# EAGLE design MagEnc (EAGLE 4.15)
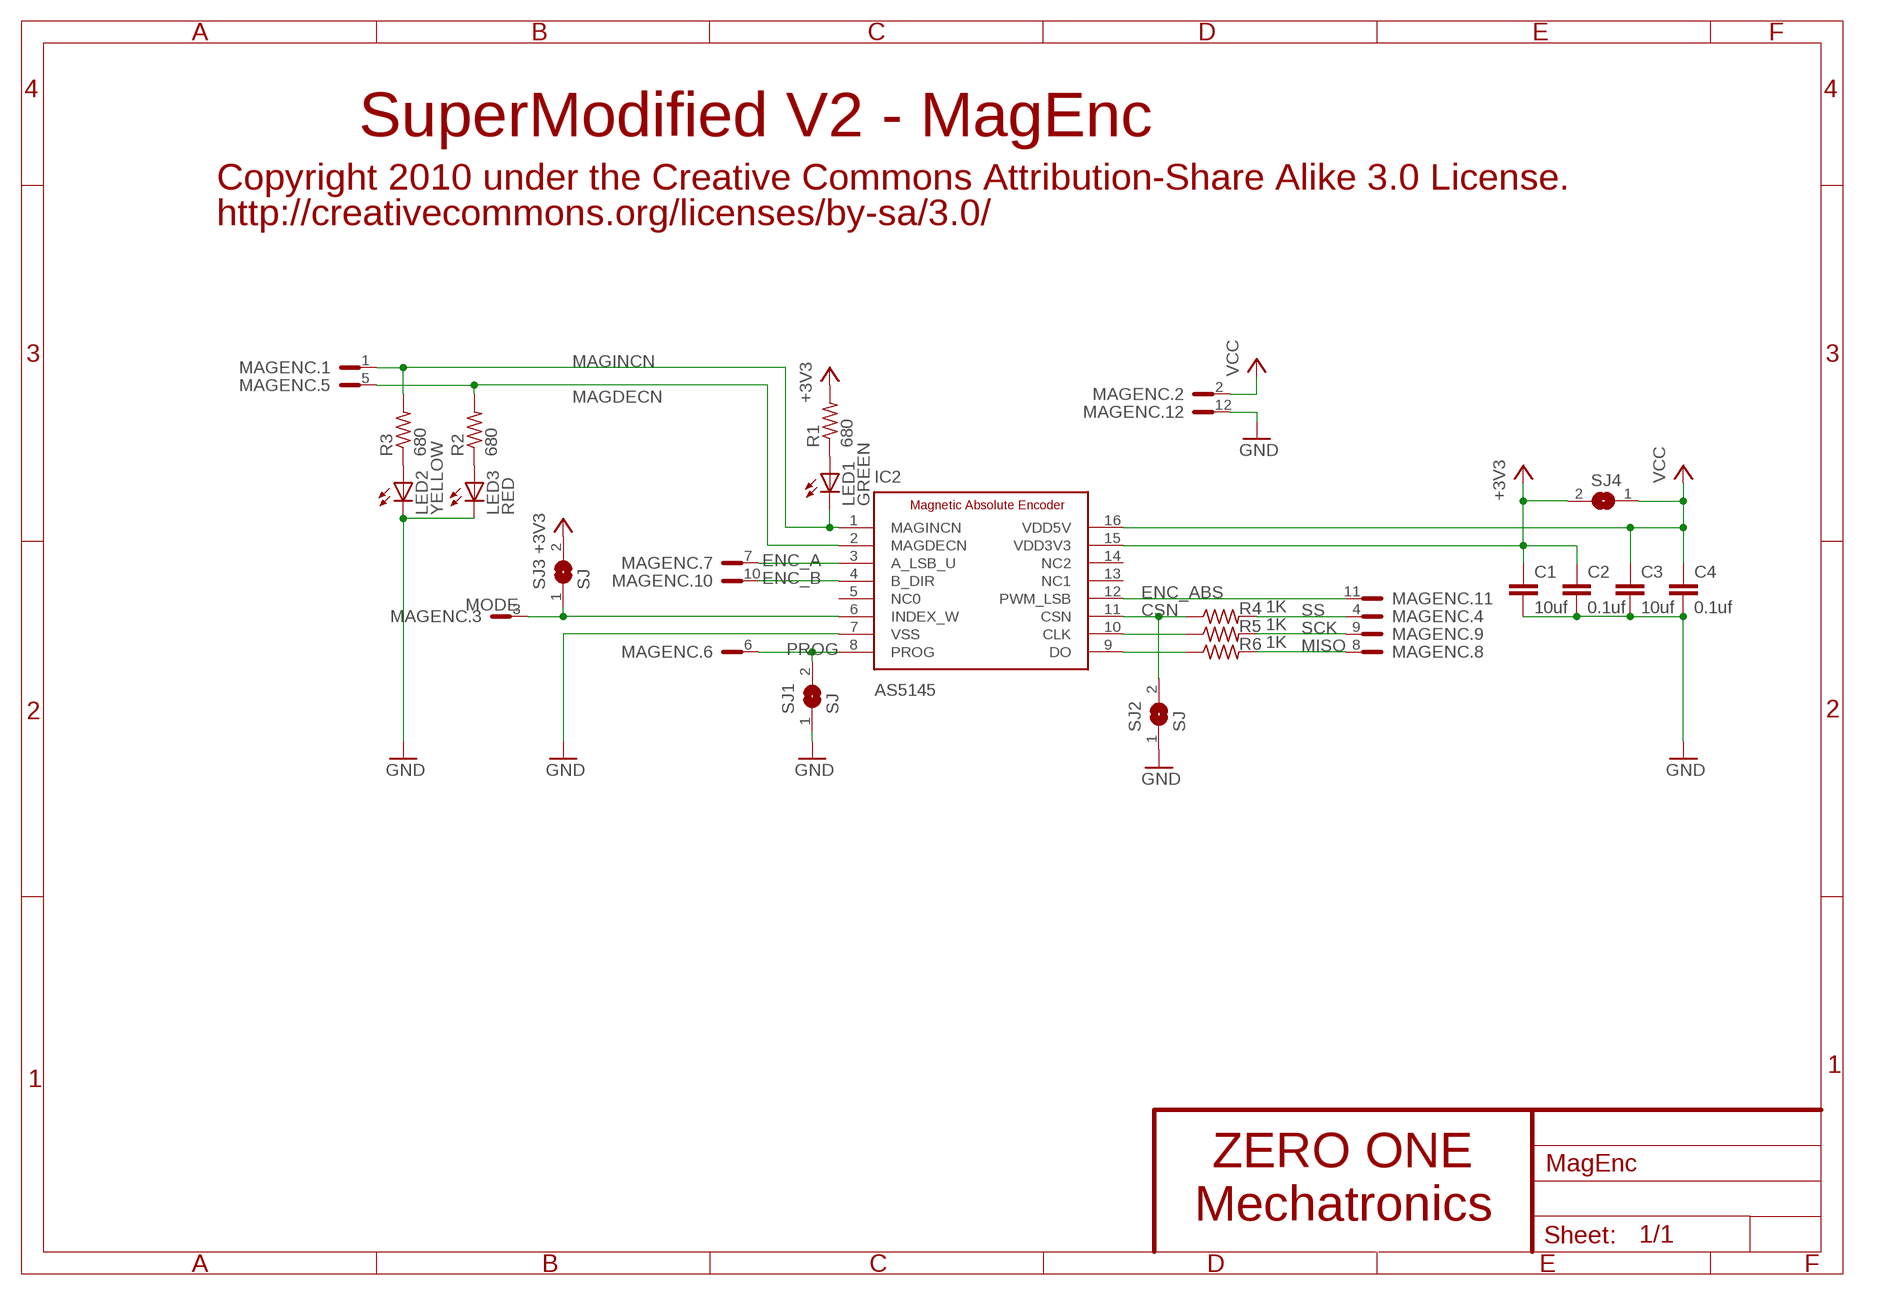
[diagram p0: schematic, sheet 1]

## Parts
C1  10uf  C-EUC0805K  [C0805K]
C2  0.1uf  C-EUC0603K  [C0603K]
C3  10uf  C-EUC0805K  [C0805K]
C4  0.1uf  C-EUC0603K  [C0603K]
IC2  AS5145  ADS5040  [SSOP16]
LED1  GREEN  LEDCHIPLED_0805  [CHIPLED_0805]
LED2  YELLOW  LEDCHIPLED_0805  [CHIPLED_0805]
LED3  RED  LEDCHIPLED_0805  [CHIPLED_0805]
MAGENC  SMSPINS  [SMSPINS]
R1  680  R-US_R0603  [R0603]
R2  680  R-US_R0603  [R0603]
R3  680  R-US_R0603  [R0603]
R4  1K  R-US_R0402  [R0402]
R5  1K  R-US_R0402  [R0402]
R6  1K  R-US_R0402  [R0402]
SJ1  SJ  [SJ]
SJ2  SJ  [SJ]
SJ3  SJ  [SJ]
SJ4  SJ  [SJ]

## Nets
+3V3: C1.1 C2.1 IC2.15(VDD3V3) R1.2 SJ3.2 SJ4.2
CSN: IC2.11(CSN) R4.1 SJ2.2
ENC_A: IC2.3(A_LSB_U) MAGENC.7
ENC_ABS: IC2.12(PWM_LSB) MAGENC.11
ENC_B: IC2.4(B_DIR) MAGENC.10
GND: C1.2 C2.2 C3.2 C4.2 IC2.7(VSS) LED2.C LED3.C MAGENC.12 SJ1.1 SJ2.1
MAGDECN: IC2.2(MAGDECN) MAGENC.5 R2.2
MAGINCN: IC2.1(MAGINCN) LED1.C MAGENC.1 R3.2
MISO: MAGENC.8 R6.2
MODE: IC2.6(INDEX_W) MAGENC.3 SJ3.1
N$1: LED1.A R1.1
N$4: LED3.A R2.1
N$5: LED2.A R3.1
N$10: IC2.10(CLK) R5.1
N$11: IC2.9(DO) R6.1
PROG: IC2.8(PROG) MAGENC.6 SJ1.2
SCK: MAGENC.9 R5.2
SS: MAGENC.4 R4.2
VCC: C3.1 C4.1 IC2.16(VDD5V) MAGENC.2 SJ4.1
Unconnected: IC2.5(NC0) IC2.13(NC1) IC2.14(NC2)

## Notes on the sheet
- SuperModified V2 - MagEnc
- Copyright 2010 under the Creative Commons Attribution-Share Alike 3.0 License.
- http://creativecommons.org/licenses/by-sa/3.0/
- ZERO ONE
- Mechatronics

## Library data of the parts
C1-C4 = rcl:C-EU: CAPACITOR, European symbol
IC2 = zo_TMS320DMC:ADS5040
LED1-LED3 = led:LED: LED OSRAM: - CHIPLED LG R971, LG N971, LY N971, LG Q971, LY Q971, LO R971, LY R971 LH N974, LH R974 LS Q976, LO Q976, LY Q976 LO Q996 - Hyper CHIPLED LW Q18S LB Q993, LB Q99A, LB R99A - SideLED LS A670, LO A670, LY A670, LG A670, LP A670 LB A673, LV A673, LT A673, LW A673 LH A674 LY A675 LS A676, LA A676, LO A676, LY A676, LW A676 LS A679, LY A679, LG A679 - Hyper Micro SIDELED® LS Y876, LA Y876, LO Y876, LY Y876 LT Y87S - SmartLED LW L88C, LW L88S LB L89C, LB L89S, LG L890 LS L89K, LO L89K, LY L89K LS L896, LA L896, LO L896, LY L896 - TOPLED LS T670, LO T670, LY T670, LG T670, LP T670 LSG T670, LSP T670, LSY T670, LOP T670, LYG T670 LG T671, LOG T671, LSG T671 LB T673, LV T673, LT T673, LW T673 LH T674 LS T676, LA T676, LO T676, LY T676, LB T676, LH T676, LSB T676, LW T676 LB T67C, LV T67C, LT T67C, LS T67K, LO T67K, LY T67K, LW E67C LS E67B, LA E67B, LO E67B, LY E67B, LB E67C, LV E67C, LT E67C LW T67C LS T679, LY T679, LG T679 LS T770, LO T770, LY T770, LG T770, LP T770 LB T773, LV T773, LT T773, LW T773 LH T774 LS E675, LA E675, LY E675, LS T675 LS T776, LA T776, LO T776, LY T776, LB T776 LHGB T686 LT T68C, LB T68C - Hyper Mini TOPLED® LB M676 - Mini TOPLED Santana® LG M470 LS M47K, LO M47K, LY M47K Source: http://www.osram.convergy.de/
MAGENC = sms:SMSPINS
R1-R6 = rcl:R-US_: RESISTOR, American symbol
SJ1-SJ4 = sms:SJ

## Board
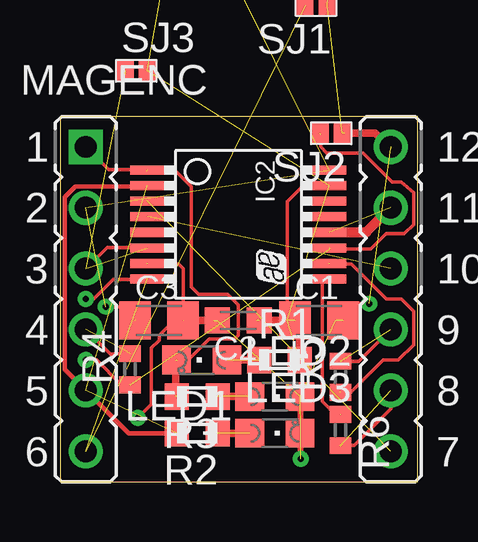
[diagram p1: board, top side]
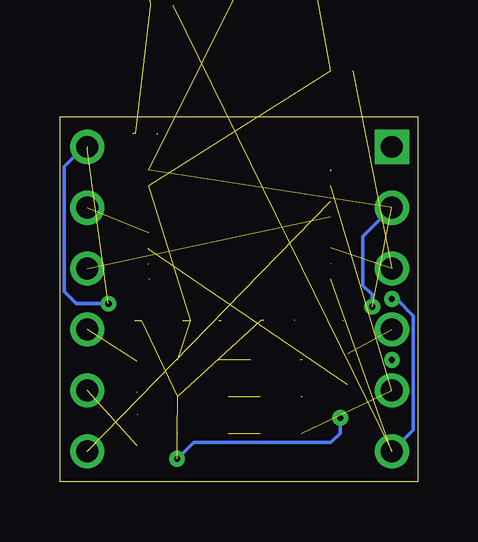
[diagram p2: board, bottom side, seen from below]

Size 14.91 x 15.23 mm. Coordinates in mm from the lower left corner, seen from the top.
Outline: 0,0 14.91,0 14.91,15.23 0,15.23 0,0
Copper layers (1*16): Top 0.035mm / dielectric 1.5mm / Bottom 0.035mm
Design rules "default": minimum track width 10mil, minimum drill 24mil, track to track 8mil, track to pad 8mil, pad to pad 8mil, via to via 8mil, smd to smd 8mil, copper to edge 40mil, drill to drill 8mil, minimum pad ring 10mil, minimum via ring 8mil, stop-mask expansion 4mil, vias tented up to drill 0mil, thermal gap 10mil

### Footprints (pad centres in the part's own frame; a part is rotated, then mirrored left to right if it is on the bottom)
C0805K = smd 1.3 x 1.6: 1 -1,0; 2 1,0
C0603K = smd 1.05 x 1.08: 1 -0.875,0; 2 0.875,0
SSOP16 = smd 0.381 x 1.422: 1 -2.275,-3.791; 2 -1.625,-3.791; 3 -0.975,-3.791; 4 -0.325,-3.791; 5 0.325,-3.791; 6 0.975,-3.791; 7 1.625,-3.791; 8 2.275,-3.791; 9 2.275,3.791; 10 1.625,3.791; 11 0.975,3.791; 12 0.325,3.791; 13 -0.325,3.791; 14 -0.975,3.791; 15 -1.625,3.791; 16 -2.275,3.791
CHIPLED_0805 = smd 1.2 x 1.2: A 0,-1.05; C 0,1.05
SMSPINS = drill 0.914 square: 1 -6.35,6.35 | drill 0.914 round: 2 -6.35,3.81; 3 -6.35,1.27; 4 -6.35,-1.27; 5 -6.35,-3.81; 6 -6.35,-6.35; 7 6.35,-6.35; 8 6.35,-3.81; 9 6.35,-1.27; 10 6.35,1.27; 11 6.35,3.81; 12 6.35,6.35
R0603 = smd 1 x 1.1: 1 -0.85,0; 2 0.85,0
R0402 = smd 0.7 x 0.9: 1 -0.65,0; 2 0.65,0
SJ = smd 0.7 x 0.9: 1 -0.46,0; 2 0.46,0

### Placement (x,y rotation side)
C1  10.79,6.73 0 top
C2  7.43,6.73 180 top
C3  4.13,6.73 0 top
C4  11.68,27.24 270 top  (outside the outline)
IC2  7.43,10.73 270 top
LED1  5.91,5.08 90 top
LED2  8.95,3.56 270 top
LED3  8.95,2.03 270 top
MAGENC  7.43,7.62 0 top
R1  9.14,5.08 0 top
R2  5.71,2.03 180 top
R3  5.71,3.56 180 top
R4  2.92,4.7 90 top
R5  11.68,4.38 90 top
R6  11.68,2.16 270 top
SJ1  10.67,19.88 180 top  (outside the outline)
SJ2  11.3,14.54 180 top
SJ3  3.17,17.14 0 top
SJ4  4.89,26.67 0 top  (outside the outline)

### Tracks (layer width: path | path; a pad name or v marks a point on that pad's centre or on a via)
+3V3  (6 unrouted)
  Top 0.152: 9.46,6.73 9.46,11.68 10.1,12.32 11.24,12.32
  Top 0.254: 9.97,5.08 9.97,6.22 9.46,6.73
  Top 0.305: 9.46,6.73 8.19,6.73
CSN  (3 unrouted)
  Top 0.152: 11.24,9.72 12.95,9.72 13.59,10.35 14.35,10.35 14.73,10.73 14.73,12.06 14.22,12.51 13.84,12.51 12.64,13.72 11.11,13.72 10.86,13.97 10.86,14.48 10.92,14.54
ENC_A  (1 unrouted)
ENC_ABS  (1 unrouted)
  Top 0.406: 10.99,10.41 12.76,10.41 MAGENC.11
ENC_B  (1 unrouted)
GND  (via drill 0.25 pad 0.03)  (14 unrouted)
  Top 0.152: 3.62,9.08 4.95,9.08 5.14,8.89 5.14,6.73 4.76,6.73 4.13,6.1 4.13,5.91 3.81,5.59 3.81,3.24 v3.24,2.67 | v12.89,7.43 12.19,7.43 11.49,6.73
  Top 0.254: v10.03,0.95 10.03,3.49 9.97,3.56
  Top 0.305: 11.87,14.54 13.14,14.54 13.78,13.91 | 5.14,6.73 6.41,6.73
  Bottom 0.152: v12.89,7.43 14.22,7.43 14.73,7.94 14.73,13.14 13.91,13.97 MAGENC.12 | v3.24,2.67 3.24,2.03 3.62,1.65 9.34,1.65 v10.03,0.95
MAGDECN  (2 unrouted)
  Top 0.178: 3.62,12.32 0.64,12.32 0.19,11.87 0.19,4.7 MAGENC.5 2.86,2.03 4.89,2.03
MAGINCN  (5 unrouted)
  Top 0.152: 3.62,13.02 2.03,13.02 MAGENC.1 | 4.89,5.08 5.33,5.08 6.22,5.97 7.3,5.97 7.43,6.1 7.43,7.37 6.99,7.81 5.78,7.81 5.46,8.13 5.46,12.32 4.83,12.95 3.62,12.95
  Top 0.305: 4.83,3.56 4.83,5.08
MISO  (1 unrouted)
  Top 0.152: 11.68,1.52 12.26,1.52 13.78,3.05 MAGENC.8
MODE  (2 unrouted)
  Top 0.152: 3.62,9.78 1.97,9.78 MAGENC.3
N$1  (1 unrouted)
N$2
  Top 0.305: 6.54,2.03 7.87,2.03
N$3
  Top 0.305: 6.54,3.56 7.87,3.56
N$4  (1 unrouted)
N$5  (1 unrouted)
N$6
  Top 0.305: 6.99,5.08 8.32,5.08
N$9  (via drill 0.25 pad 0.03)
  Top 0.152: 2.92,4.06 2.54,4.06 1.52,5.08 v1.08,5.08
N$10  (2 unrouted)
  Top 0.152: 11.24,9.08 12.13,9.08 13.59,7.62 14.22,7.62 14.73,7.11 14.73,5.71 14.1,5.08 13.46,5.08 12.13,3.75 11.68,3.75
N$11  (2 unrouted)
  Top 0.152: 11.68,2.79 11.49,2.79 10.92,3.37 10.92,8.32 10.99,8.38 11.11,8.38 11.18,8.45
PROG  (via drill 0.25 pad 0.03)  (2 unrouted)
  Top 0.152: v1.08,7.62 1.4,7.62 2.22,8.45 3.62,8.45
  Bottom 0.152: v1.08,7.62 0.89,7.62 0.19,6.92 0.19,2.16 MAGENC.6
SCK  (1 unrouted)
  Top 0.152: 11.68,5.02 12.45,5.02 MAGENC.9
SS  (1 unrouted)
  Top 0.152: 2.86,5.33 2.1,5.33 MAGENC.4
VCC  (via drill 0.25 pad 0.03)  (5 unrouted)
  Top 0.152: v1.91,7.3 2.54,7.3 3.11,6.73
  Bottom 0.152: v1.91,7.3 1.91,7.81 2.29,8.19 2.29,10.22 MAGENC.2